# EAGLE design MainBoard 1.3.2 (EAGLE 9.6.2)
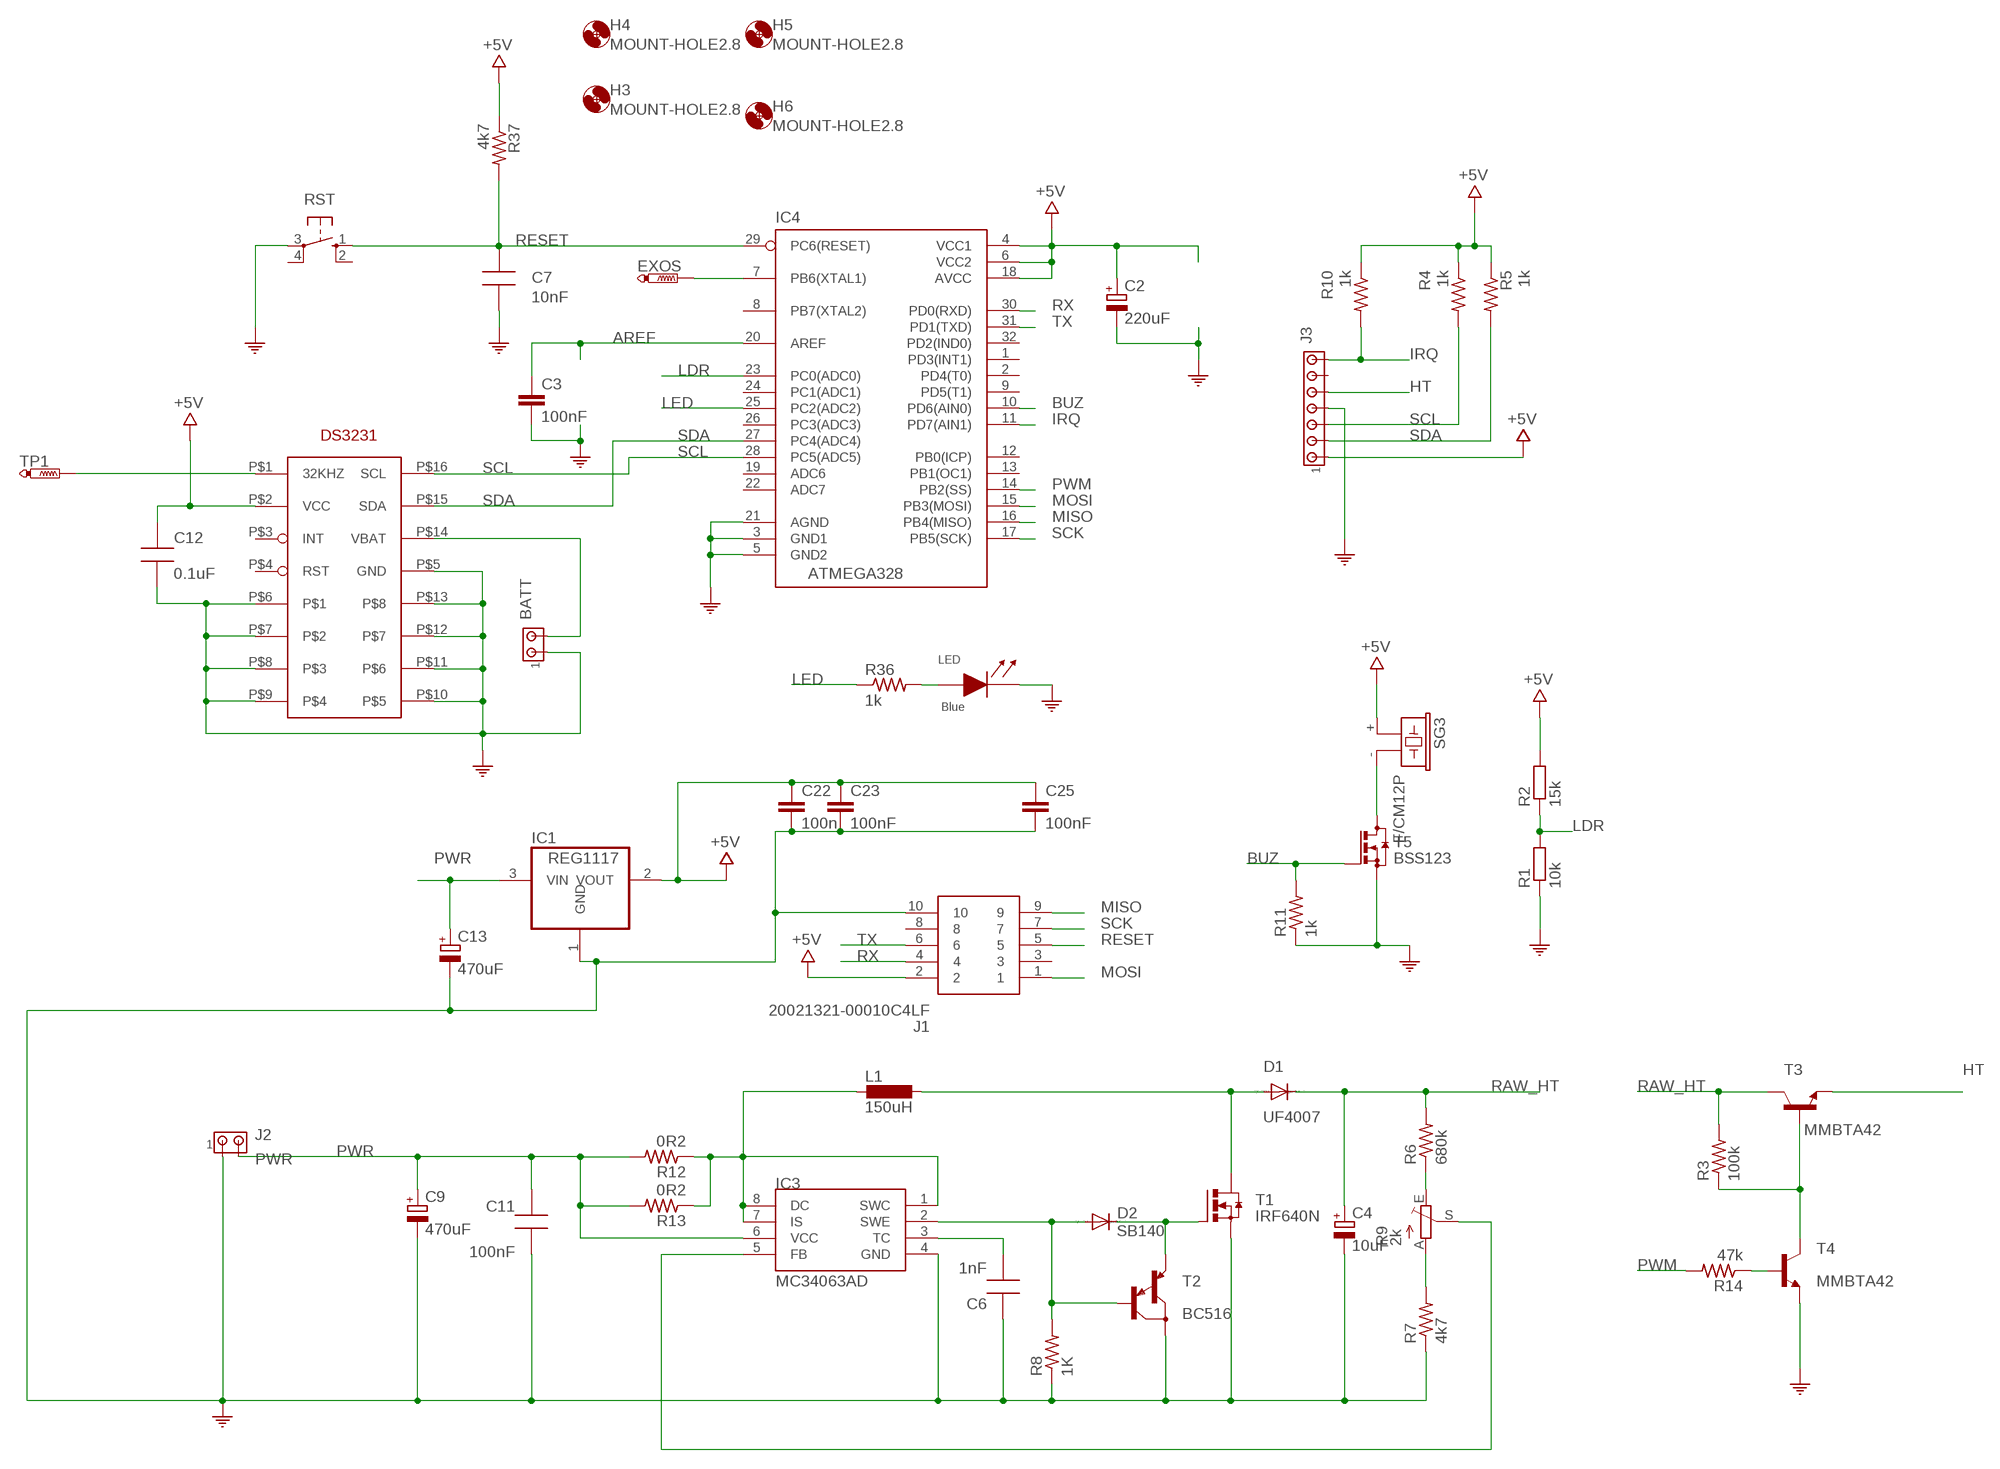
[diagram p0: schematic, sheet 1]

## Parts
BATT  MTA02-100  [10X02MTA]
C2  220uF  CPOL-EUSMCD  [SMC_D]
C3  100nF  C-EUC0603  [C0603]
C4  10uF  CPOL-EUE3.5-10  [E3,5-10]
C6  1nF  CAP0805-NP  [CAP0805-NP]
C7  10nF  CAP0805-NP  [CAP0805-NP]
C9  470uF  CPOL-EUSMCD  [SMC_D]
C11  100nF  CAP0805-NP  [CAP0805-NP]
C12  0.1uF  CAP0805-NP  [CAP0805-NP]
C13  470uF  CPOL-EUSMCD  [SMC_D]
C22  100n  C-EUC0603  [C0603]
C23  100nF  C-EUC0603  [C0603]
C25  100nF  C-EUC0603  [C0603]
D1  UF4007  BYT01  [F126-10]
D2  SB140  DIODE-DO07  [DO07]
EXOS  PTR1TP09R  [TP09R]
H3  MOUNT-HOLE2.8  [2,8]
H4  MOUNT-HOLE2.8  [2,8]
H5  MOUNT-HOLE2.8  [2,8]
H6  MOUNT-HOLE2.8  [2,8]
IC1  REG1117  [SOT223]
IC3  MC34063AD  [SOIC8]
IC4  ATMEGA328  ATMEGA168-20AU  [QFP032]
IC5  DS3231SPIC16W  [SOIC-16W]
J1  20021321-00010C4LF  [2002132100010C4LF]
J2  PWR  MTA02-100  [10X02MTA]
J3  MTA07-100  [10X07MTA]
L1  150uH  DO3316P  [D0522P]
LED  Blue  LED0805  [LED0805]
R1  10k  R-EU_M2012  [M2012]
R2  15k  R-EU_0204/2V  [0204V]
R3  100k  R-US_R2012  [R2012]
R4  1k  R-US_M2012  [M2012]
R5  1k  R-US_M2012  [M2012]
R6  680k  R-US_R2012  [R2012]
R7  4k7  R-US_R2012  [R2012]
R8  1K  R-US_R2012  [R2012]
R9  2k  TRIM_EU-B25P  [B25P]
R10  1k  R-US_M2012  [M2012]
R11  1k  R-US_M2012  [M2012]
R12  0R2  R-US_R2010  [R2010]
R13  0R2  R-US_R2010  [R2010]
R14  47k  R-US_R2012  [R2012]
R36  1k  R-US_M2012  [M2012]
R37  4k7  R-US_M2012  [M2012]
RST  10-XX  [B3F-10XX]
SG3  F/CM12P  [F/CM12P]
T1  IRF640N  IRF3704S  [D2PACK]
T2  BC516  [TO92]
T3  MMBTA42  BC846  [SOT23]
T4  MMBTA42  BC846  [SOT23]
T5  BSS123  [SOT23]
TP1  PTR1TP09R  [TP09R]

## Nets
+5V [pwr]: C2.+ C12.1 C22.1 C23.1 C25.1 IC1.2(VOUT) IC4.4(VCC1) IC4.6(VCC2) IC4.18(AVCC) IC5.P$2(VCC) J1.2 J3.1 R2.2 R4.1 R5.1 R10.1 R37.1 SG3.+
AREF: C3.1 IC4.20(AREF)
BATT: BATT.2 IC5.P$14(VBAT)
BUZ: IC4.10(PD6(AIN0)) R11.2 T5.1(G)
GND: BATT.1 C2.- C3.2 C4.- C6.1 C7.2 C9.- C11.1 C12.2 C13.- C22.2 C23.2 C25.2 IC1.1(GND) IC3.4(GND) IC4.3(GND1) IC4.5(GND2) IC4.21(AGND) IC5.P$5(GND) IC5.P$6 IC5.P$7 IC5.P$8 IC5.P$9 IC5.P$10 IC5.P$11 IC5.P$12 IC5.P$13 J1.10 J2.1 J3.4 LED.1(CA) R1.1 R7.1 R8.1 R11.1 RST.3(P) T1.3(S) T2.3(C) T4.2(E) T5.2(S) ; supply symbol labelled COM
HT: J3.5 T3.2(E)
IRQ: IC4.11(PD7(AIN1)) J3.7 R10.2
LDR: IC4.23(PC0(ADC0)) R1.2 R2.1
LED: IC4.25(PC2(ADC2)) R36.1
MISO: IC4.16(PB4(MISO)) J1.9
MOSI: IC4.15(PB3(MOSI)) J1.1
N$1: IC5.P$1(32KHZ) TP1.TP
N$2: D1.A L1.P$2 T1.2(D)
N$3: SG3.- T5.3(D)
N$5: EXOS.TP IC4.7(PB6(XTAL1))
N$6: C6.2 IC3.3(TC)
N$7: R3.1 T3.1(B) T4.3(C)
N$9: R7.2 R9.A
N$10: D2.A IC3.2(SWE) R8.2 T2.2(B)
N$11: R6.1 R9.E
N$15: LED.2(AN) R36.2
N$16: IC3.5(FB) R9.S
N$17: IC3.1(SWC) IC3.7(IS) IC3.8(DC) L1.P$1 R12.1 R13.1
N$19: R14.1 T4.1(B)
N$21: D2.C T1.1(G) T2.1(E)
PWM: IC4.14(PB2(SS)) R14.2
PWR [pwr]: C9.+ C11.2 C13.+ IC1.3(VIN) IC3.6(VCC) J2.2 R12.2 R13.2
RAW_HT: C4.+ D1.C R3.2 R6.2 T3.3(C)
RESET: C7.1 IC4.29(PC6(RESET)) J1.5 R37.2 RST.1(S)
RX: IC4.30(PD0(RXD)) J1.4
SCK: IC4.17(PB5(SCK)) J1.7
SCL: IC4.28(PC5(ADC5)) IC5.P$16(SCL) J3.3 R4.2
SDA: IC4.27(PC4(ADC4)) IC5.P$15(SDA) J3.2 R5.2
TX: IC4.31(PD1(TXD)) J1.6
Unconnected: IC4.1(PD3(INT1)) IC4.2(PD4(T0)) IC4.8(PB7(XTAL2)) IC4.9(PD5(T1)) IC4.12(PB0(ICP)) IC4.13(PB1(OC1)) IC4.19(ADC6) IC4.22(ADC7) IC4.24(PC1(ADC1)) IC4.26(PC3(ADC3)) IC4.32(PD2(IND0)) IC5.P$3(INT) IC5.P$4(RST) J1.3 J1.8 J3.6 RST.2(S1) RST.4(P1)

## Library data of the parts
BATT J2 = con-amp:MTA02-100: AMP connector
C2 C9 C13 = rcl:CPOL-EU: POLARIZED CAPACITOR, European symbol
C3 C22 C23 C25 = rcl:C-EU: CAPACITOR, European symbol; SPICEPREFIX: C
C4 = resistor:CPOL-EU: POLARIZED CAPACITOR, European symbol
C6 C7 C11 C12 = MySMD:CAP0805-NP
D1 = diode:BYT01: DIODE ultra fast
D2 = diode:DIODE-: DIODE
EXOS TP1 = testpad:PTR1: TEST PIN
H3-H6 = holes:MOUNT-HOLE: MOUNTING HOLE with drill center marker
IC1 = burr-brown:REG1117: 800mA and 1A Low Dropout (LDO) Positive Regulator 1.8V, 2.5V, 2.85V, 3.3V, 5V, and Adj; MPN: REG1117; OC_FARNELL: 1097566; OC_NEWARK: 14P6981
IC3 = mc34063:MC34063
IC4 = MySMD:ATMEGA168-20AU
IC5 = DS3231:DS3231; MOUSER: 700-DS3231S#
J1 = SamacSys_Parts:20021321-00010C4LF: Headers & Wire Housings 1.27x1.27mm BTB, Hdr Recept, SMT, 10 Pos Source: Datasheet <https://componentsearchengine.com/Datasheets/1/20021321-00010C4LF.pdf>; DESCRIPTION: Headers & Wire Housings 1.27x1.27mm BTB, Hdr Recept, SMT, 10 Pos; HEIGHT: 4.75mm; MANUFACTURER_NAME: Amphenol; MANUFACTURER_PART_NUMBER: 20021321-00010C4LF; MOUSER_PART_NUMBER: 649-202132100010C4LF; MOUSER_PRICE-STOCK: https://www.mouser.com/Search/Refine.aspx?Keyword=649-202132100010C4LF
J3 = con-amp:MTA07-100: AMP connector
L1 = inductor-coilcraft:DO3316P: COILCRAFT; MOUSER: 994-DO5022P-154MLB
LED = MySMD:LED0805
R1 R2 = resistor:R-EU_: RESISTOR, European symbol
R3-R8 R10-R14 R36 R37 = adafruit:R-US_: RESISTOR, American symbol
R9 = pot:TRIM_EU-: POTENTIOMETER
RST = switch-omron:10-XX: OMRON SWITCH; MPN: B3F-1000; OC_FARNELL: 176432; OC_NEWARK: 36M3542
SG3 = buzzer:F/CM12P: BUZZER Source: Buerklin; OC_FARNELL: unknown; OC_NEWARK: unknown
T1 = transistor-power:IRF3704: SMPS MOSFET HEXFET® Power MOSFET Source: http://www.irf.com/product-info/datasheets/data/irf3704.pdf; MOUSER: 942-IRF640NSTRLPBF
T2 = transistor-pnp:BC516: PNP Darlington Transistor
T3 T4 = transistor:BC846: NPN TRANSISTOR
T5 = transistor-small-signal:BSS123: N-CHANNEL MOS FET; MOUSER: 512-BSS123

## Module TUBEIN16
Ports: 

### Library data of the parts

## Net classes
0 default: width 0.254 mm, clearance 0.254 mm
1 pwr: width 0.254 mm, clearance 0.356 mm

## Board
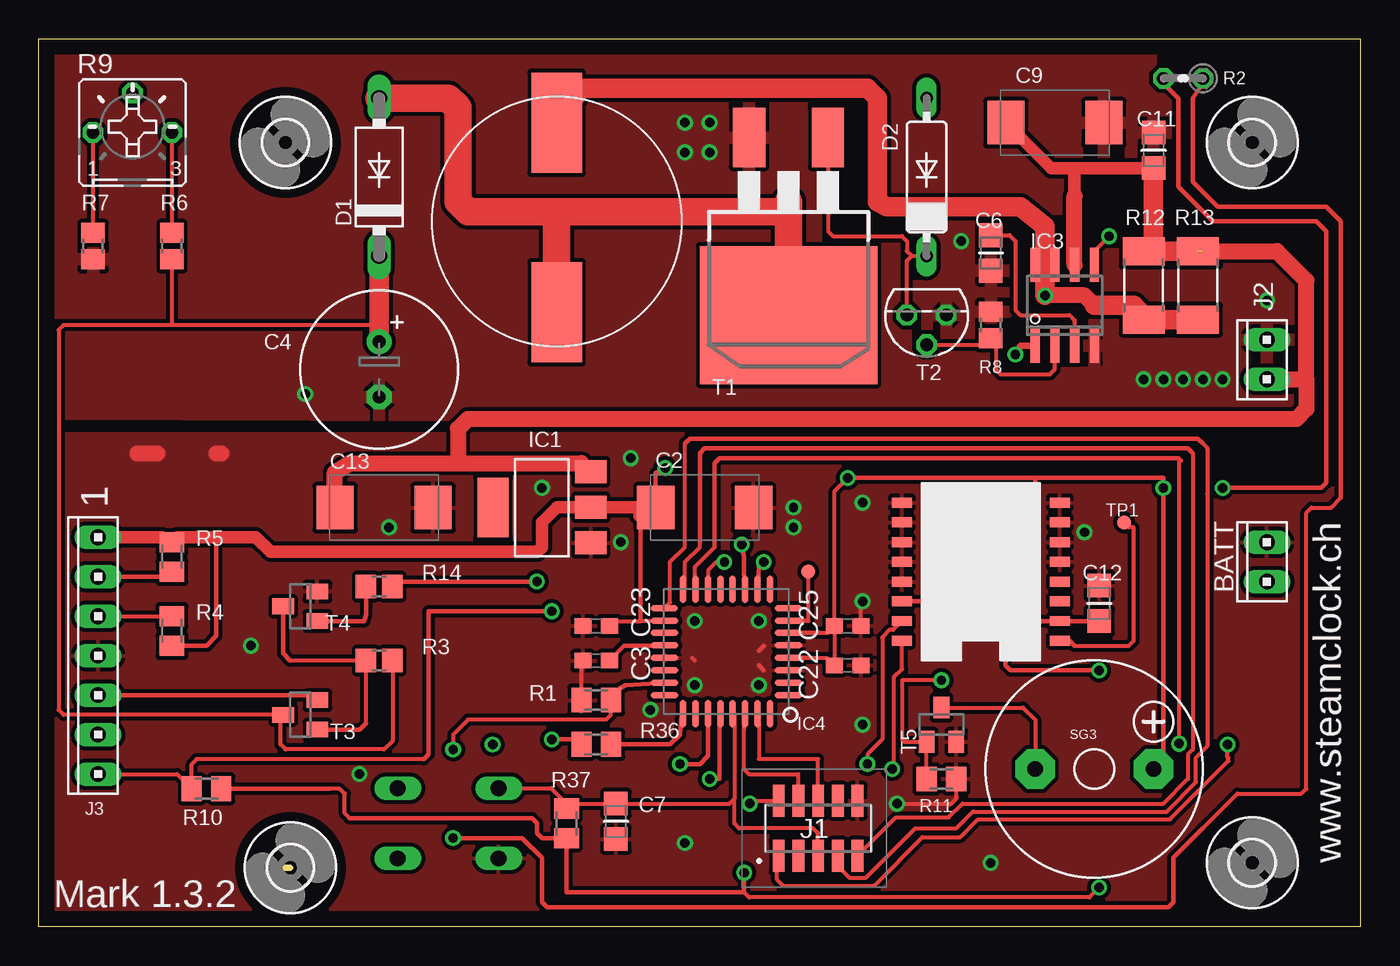
[diagram p1: board, top side]
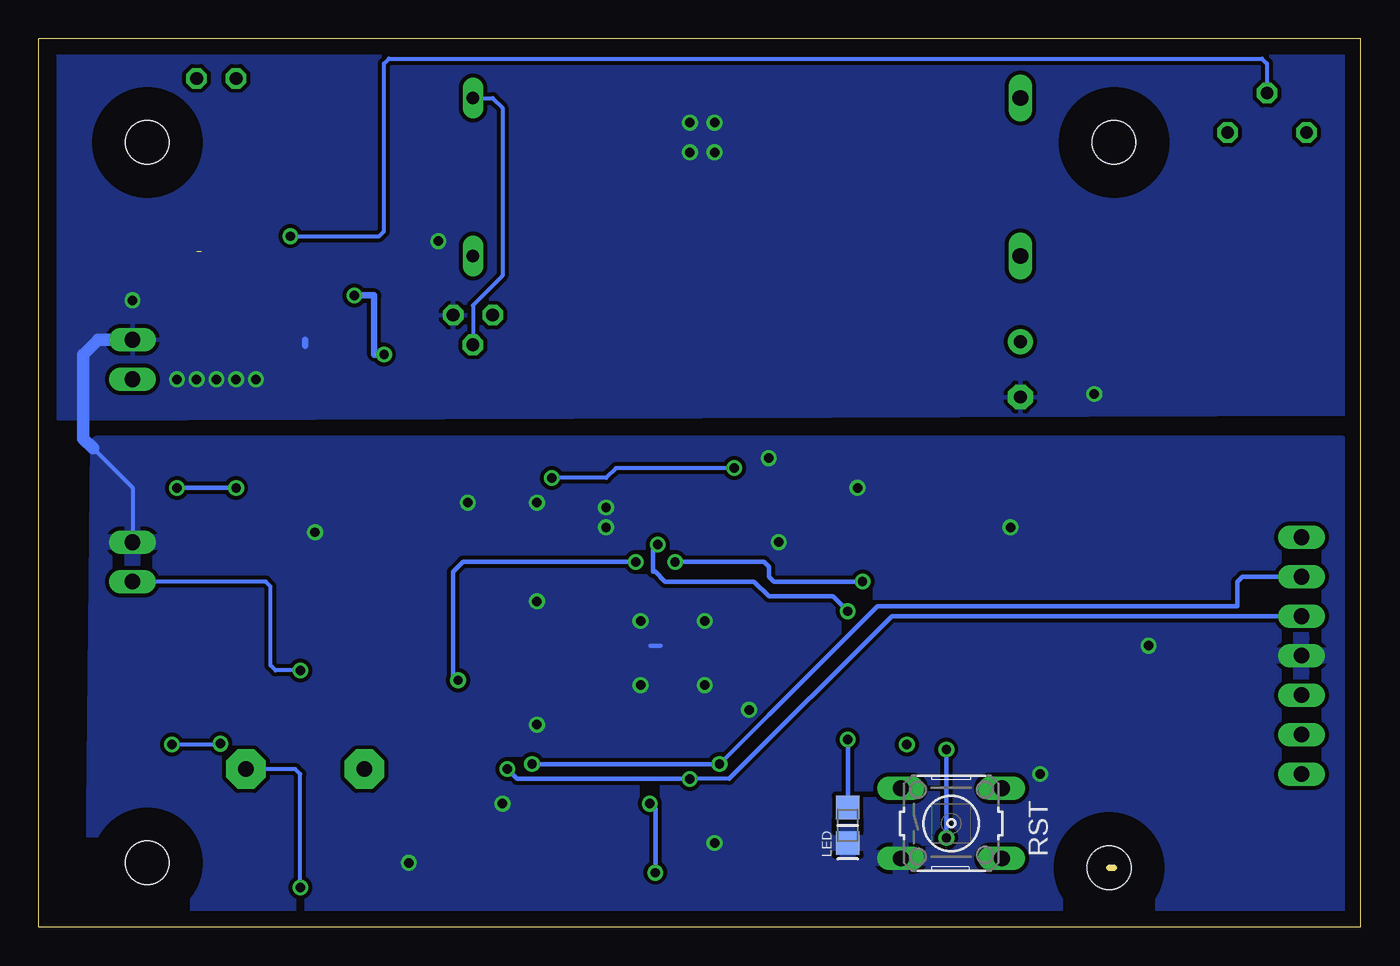
[diagram p2: board, bottom side, seen from below]

Size 85.09 x 57.15 mm. Coordinates in mm from the lower left corner, seen from the top.
Outline: 16.19,3.81 15.88,3.81
Outline: 85.09,0 85.09,57.15 0,57.15 0,0 85.09,0
Copper layers (1*16): Top 0.035mm / dielectric 1.5mm / Bottom 0.035mm
Design rules "default": minimum track width 10mil, minimum drill 24mil, track to track 8mil, track to pad 8mil, pad to pad 8mil, via to via 8mil, smd to smd 8mil, copper to edge 40mil, drill to drill 8mil, minimum pad ring 10mil, minimum via ring 8mil, stop-mask expansion 4mil, vias tented up to drill 0mil, thermal gap 10mil

### Footprints (pad centres in the part's own frame; a part is rotated, then mirrored left to right if it is on the bottom)
10X02MTA = drill 1.016 long: 1 1.27,0; 2 -1.27,0
SMC_D = smd 2.4 x 2.8: + -3.15,0; - 3.15,0
C0603 = smd 1.1 x 1: 1 -0.85,0; 2 0.85,0
E3,5-10 = drill 0.813 pad 1.6: + -1.778,0 | drill 0.813 pad 1.6 octagon: - 1.778,0
CAP0805-NP = smd 1.524 x 1.524: 1 0,0; 2 2.286,0
F126-10 = drill 1.016 long: A 5.08,0; C -5.08,0
DO07 = drill 0.813 long: A 5.08,0; C -5.08,0
TP09R = smd 0.9 x 0.9: TP 0,0
2,8 = hole 2.8: 0,0
SOT223 = smd 1.499 x 2.007: 1 -2.261,-3.15; 2 0.025,-3.15; 3 2.311,-3.15 | smd 3.81 x 2.007: 4 0,3.15
SOIC8 = smd 0.6 x 2.2: 1 -1.905,-2.6; 2 -0.635,-2.6; 3 0.635,-2.6; 4 1.905,-2.6; 5 1.905,2.6; 6 0.635,2.6; 7 -0.635,2.6; 8 -1.905,2.6
QFP032 = smd 0.432 x 1.778: 1 0,0; 2 0.8,0; 3 1.599,0; 4 2.399,0; 5 3.199,0; 6 3.998,0; 7 4.798,0; 8 5.598,0; 17 5.588,8.001; 18 4.798,7.997; 19 3.998,7.997; 20 3.199,7.997; 21 2.399,7.997; 22 1.599,7.997; 23 0.799,7.997; 24 0,7.997 | smd 1.778 x 0.432: 9 6.807,1.194; 10 6.807,2.007; 11 6.807,2.794; 12 6.807,3.607; 13 6.807,4.394; 14 6.807,5.182; 15 6.807,5.994; 16 6.816,6.803; 25 -1.194,6.807; 26 -1.194,5.994; 27 -1.194,5.182; 28 -1.194,4.394; 29 -1.194,3.607; 30 -1.194,2.794; 31 -1.194,2.007; 32 -1.194,1.194
SOIC-16W = smd 0.635 x 1.27: P$1 -16.51,-1.27; P$2 -15.24,-1.27; P$3 -13.97,-1.27; P$4 -12.7,-1.27; P$5 -11.43,-1.27; P$6 -10.16,-1.27; P$7 -8.89,-1.27; P$8 -7.62,-1.27; P$9 -7.62,8.89; P$10 -8.89,8.89; P$11 -10.16,8.89; P$12 -11.43,8.89; P$13 -12.7,8.89; P$14 -13.97,8.89; P$15 -15.24,8.89; P$16 -16.51,8.89
2002132100010C4LF = smd 0.76 x 2.05: 1 2.54,1.775; 2 2.54,-1.775; 3 1.27,1.775; 4 1.27,-1.775; 5 0,1.775; 6 0,-1.775; 7 -1.27,1.775; 8 -1.27,-1.775; 9 -2.54,1.775; 10 -2.54,-1.775
10X07MTA = drill 1.016 long: 1 7.62,0; 2 5.08,0; 3 2.54,0; 4 0,0; 5 -2.54,0; 6 -5.08,0; 7 -7.62,0
D0522P = smd 3.251 x 6.452: P$1 0,6.35; P$2 0,-5.842
LED0805 = smd 1.524 x 1.524: 1 0,0; 2 2.286,0
M2012 = smd 1.3 x 1.6: 1 -0.95,0; 2 0.95,0
0204V = drill 0.813 octagon: 1 -1.27,0; 2 1.27,0
R2012 = smd 1.3 x 1.5: 1 -0.85,0; 2 0.85,0
B25P = drill 0.813 octagon: A -2.54,0; E 2.54,0; S 0,2.54
R2010 = smd 1.8 x 2.7: 1 -2.2,0; 2 2.2,0
B3F-10XX = drill 1.016 long: 1 -3.251,2.261; 2 3.251,2.261; 3 -3.251,-2.261; 4 3.251,-2.261
F/CM12P = drill 1.016 pad 2.54 octagon: + 3.81,0; - -3.81,0
D2PACK = smd 2.083 x 3.81: 1 -2.54,-8.89; 3 2.54,-8.89 | smd 11.43 x 8.89: 2 0,2.54
TO92 = drill 0.813 octagon: 1 1.27,0; 2 0,1.905; 3 -1.27,0
SOT23 = smd 1 x 1.4: 1 -0.95,-1.1; 2 0.95,-1.1; 3 0,1.1

### Placement (x,y rotation side)
BATT  79.06,23.5 90 top
C2  42.86,26.99 0 top
C3  35.88,17.14 180 top
C4  21.91,35.88 270 top
C6  61.28,42.23 90 top
C7  37.15,7.94 270 top
C9  65.41,51.75 0 top
C11  71.75,51.12 270 top
C12  68.26,19.68 90 top
C13  22.23,26.99 0 top
C22  52.07,16.83 0 top
C23  35.88,19.37 180 top
C25  52.07,19.37 0 top
D1  21.91,48.26 90 top
D2  57.15,48.26 90 top
EXOS  49.53,22.86 0 top
H3  15.88,50.48 0 top
H4  16.19,3.81 0 top
H5  78.11,4.13 0 top
H6  78.11,50.48 0 top
IC1  32.38,26.99 90 top
IC3  66.04,40.01 0 top
IC4  48.26,14.92 90 top
IC5  64.45,34.92 90 top
J1  50.16,6.35 180 top
J2  79.06,36.51 90 top
J3  3.81,17.46 90 top
L1  33.34,45.4 0 top
LED  33.02,5.4 90 bottom
R1  35.88,14.61 0 top
R2  73.66,54.61 180 top
R3  21.91,17.14 0 top
R4  8.57,19.05 90 top
R5  8.57,23.81 270 top
R6  8.57,43.81 270 top
R7  3.49,43.81 90 top
R8  61.28,38.73 270 top
R9  6.03,51.12 0 top
R10  10.79,8.89 180 top
R11  58.1,9.53 180 top
R12  71.12,41.27 90 top
R13  74.61,41.27 90 top
R14  21.91,21.91 0 top
R36  35.88,11.75 180 top
R37  33.97,6.67 90 top
RST  26.35,6.67 0 bottom
SG3  67.94,10.16 0 top
T1  48.26,41.91 180 top
T2  57.15,39.37 180 top
T3  16.83,13.65 90 top
T4  16.83,20.64 90 top
T5  58.1,13.02 0 top
TP1  69.85,26.04 180 top

### Tracks (layer width: path | path; a pad name or v marks a point on that pad's centre or on a via)
+5V  (via drill 0.6, 0.61)
  Top 0.254: 20,6.99 19.68,7.3 19.68,8.57 19.37,8.89 18.73,8.89 | v45.76,7.94 45.95,8.12 J1.2 | 50.29,18.92 50.77,18.92 C25.1 | 49.71,17.32 50.73,17.32 C22.1 C25.1 | C25.1 51.22,28.04 v52.07,28.89 | C23.1 37.05,19.68 38.73,19.68 | v68.26,2.54 67.63,1.91 45.72,1.91 45.4,2.22
  Top 0.305: IC4.6 50.29,18.92 | IC4.4 49.71,17.32 | 64.14,28.89 64.14,20 64.45,19.68 IC5.P$2 C12.1 | 64.14,28.89 72.39,28.89 v72.39,28.26 72.39,10.79 SG3.+ | 64.14,28.89 v52.07,28.89 | C2.+ 39.69,28.89 39.69,29.21 v40.32,29.53 | IC4.18 38.73,19.68 38.73,26.04 38.42,26.35 38.41,26.97 | v45.4,3.49 45.4,2.22 33.97,2.22 R37.1 32.38,5.71 32.07,6.03 32.07,6.67 31.75,6.99 20,6.99 | 18.73,8.89 R10.1 | R2.2 72.39,54.29 73.34,53.34 73.34,47.62 75.56,45.4 82.23,45.4 82.87,44.77 82.87,28.57 82.55,28.26 v76.2,28.26 | 7.94,25.08 8.26,24.76 R5.1 | R4.1 10.79,18.1 11.43,18.73 11.43,25.08
  Top 0.406: 38.41,26.97 C2.+
  Top 0.813: C2.+ 39.71,27.01 IC1.2 33.36,27.01 32.38,26.04 32.38,24.45 32.07,24.13 14.92,24.13 13.97,25.08 11.43,25.08 8.89,25.08 R5.1 | J3.1 7.94,25.08
  Bottom 0.254: v40.32,29.53 47.94,29.53 48.58,28.89 v52.07,28.89 | v68.26,2.54 68.26,9.84 68.58,10.16 SG3.+ | 45.72,7.94 v45.76,7.94
  Bottom 0.305: v76.2,28.26 v72.39,28.26 | 45.72,7.94 45.4,7.62 v45.4,3.49
AREF
  Top 0.254: C3.1 37.68,18.1 37.78,18.1
  Top 0.305: 37.78,18.1 40.24,18.1 IC4.20
BATT  (via drill 0.6)
  Top 0.305: IC5.P$14 61.91,20.95 62.23,20.64 62.23,16.83 62.55,16.51 v68.26,16.51
  Bottom 0.254: v68.26,16.51 69.85,16.51 70.17,16.83 70.17,21.91 70.48,22.23 BATT.2
BUZ  (via drill 0.6)
  Top 0.254: v58.1,15.88 55.56,15.88 55.56,12.06 55.71,11.92 T5.1 | T5.1 | R11.2 T5.1
  Top 0.305: IC4.10 46.35,23.18 v46.67,23.5
  Bottom 0.305: v58.1,15.88 58.42,16.19 58.42,22.86 57.78,23.5 v46.67,23.5
GND  (via drill 0.61)
  Top 0.254: C7.2 37.11,5.65 37.11,5.36 | 17.78,21.59 T4.2 | v55.24,7.94 58.74,7.94 59.05,8.26 R11.1 | C25.2 52.92,20.85 v53.02,20.95 | 42.05,17.32 42.23,17.14 | R1.1 34.93,17.05 C3.2 | 37.15,24.77 37.11,24.73
  Top 0.305: 46.66,16.52 46.35,16.83 | 46.35,17.78 46.67,18.1
  Top 0.406: 18.1,21.59 T4.2
  Top 1.016: 6.35,30.48 7.62,30.48 | 11.43,30.48 11.75,30.48
  Bottom 0.254: 81.6,30.8 79.06,28.26 BATT.1
  Bottom 0.305: 45.72,18.1 45.09,18.1
  Bottom 0.406: 67.94,37.78 IC3.4
  Bottom 0.813: J2.1 81.28,37.78 82.23,36.83 82.23,31.43 81.6,30.8
  other vias: 53.02,13.02 20.64,9.84 61.28,4.13 22.54,25.72 37.47,24.77 48.58,25.72 48.58,26.99 32.38,28.26 38.1,30.16 39.37,13.97 41.59,5.4 13.65,18.1 67.31,25.4 57.47,27.3 76.2,35.24 59.37,44.13 41.59,51.75 41.59,49.85 43.18,51.75 43.18,49.85 74.93,35.24 73.66,35.24 72.39,35.24 71.12,35.24 42.23,19.68 46.35,19.68 42.23,15.56 46.35,15.56 17.14,34.29 79.06,40.32 53.02,27.3
  pour Top: 0.95,56.52 0.95,33.02 83.82,32.7 83.82,55.88
  pour Bottom: 1.27,31.11 0.95,0.95 5.71,0.32 81.6,1.59 81.28,31.11
  pour Bottom (rank 6): 0.64,56.83 83.82,56.83 83.82,32.7 0.95,33.02
  pour Top: 1.59,31.75 84.45,31.75 84.45,0 0,0 0,30.16
HT
  Top 0.305: J3.5 17.46,14.92 17.78,14.6 T3.2
IRQ  (via drill 0.6)
  Top 0.254: 24.77,10.79 10.16,10.79 9.85,10.48 R10.2 8.89,9.84 J3.7
  Top 0.305: IC4.11 45.4,22.86 45.4,23.81 v45.24,24.61 | v33.02,20.32 25.08,20.32 25.08,11.11 24.77,10.79
  Bottom 0.305: v45.24,24.61 45.56,24.29 45.56,22.87 45.42,22.88 44.77,22.23 39.05,22.23 38.1,21.27 33.97,21.27 v33.02,20.32
LDR  (via drill 0.6)
  Top 0.254: R1.2 36.83,13.65 36.51,13.34 27.62,13.34 26.67,12.38 v26.67,11.43 | 74.93,6.35 77.15,8.57 81.28,8.57 81.6,8.89 81.6,26.67 81.92,26.99 83.19,26.99 83.82,27.62
  Top 0.305: 74.93,6.35 73.03,4.45 73.03,1.59 72.71,1.27 32.7,1.27 32.38,1.59 32.38,4.45 31.11,5.71 v26.67,5.71 | IC4.23 37.78,15.56 37.4,15.37 R1.2 | R2.1 74.93,54.29 74.3,53.34 74.3,47.94 75.88,46.35 82.87,46.35 83.82,45.4 83.82,27.62
  Bottom 0.305: v26.67,5.71 v26.67,11.43
LED
  Top 0.305: IC4.25 41.38,13.65 41.27,12.38 40.64,11.75 R36.1
MISO
  Top 0.254: IC4.16 41.59,21.87 41.59,23.5 42.55,24.45 42.55,24.77 | J1.9 55.18,7.05 58.57,7.05 59.46,7.94 72.39,7.94 73.98,9.53 73.98,11.11 74.3,11.43 74.3,30.48
  Top 0.305: 42.55,24.77 42.55,30.48 42.86,30.8 73.98,30.8 74.3,30.48
MOSI  (via drill 0.61)
  Top 0.254: IC4.15 42.23,21.77 42.23,23.18 43.5,24.45 | J1.1 47.5,4.45 47.5,3.08 47.91,2.66 53.78,2.66 56.9,5.78 59.31,5.78 60.45,6.92 72.81,6.92 76.58,10.69 76.58,10.86 76.52,10.92 v76.52,11.75 | v73.41,11.8 73.41,29.91 73.5,30
  Top 0.305: 43.5,24.45 43.5,29.84 43.81,30.16 73.34,30.16 73.5,30
  Bottom 0.254: v73.41,11.8 73.46,11.75 v76.52,11.75
N$1
  Top 0.254: 66.67,18.1 70.17,18.1 70.48,18.41 70.48,25.72 70.17,25.72 TP1.TP
  Top 0.305: 66.67,18.1 66.36,18.41 IC5.P$1
N$2
  Top 1.778: L1.P$2 33.34,46.04 | 33.34,46.04 27.62,46.04 26.99,46.67 26.99,52.7 26.35,53.34 D1.A | 33.34,46.04 47.94,46.04 48.26,46.67 T1.2
N$3
  Top 0.254: T5.3 63.35,14.12 64.14,13.34 SG3.-
N$5
  Top 0.254: 49.53,19.72 EXOS.TP
  Top 0.305: IC4.7 49.53,19.72
N$6
  Top 0.254: C6.2 62.48,44.51 62.87,44.13 62.87,39.69 63.18,39.37 66.36,39.37 66.67,39.05 IC3.3
N$7
  Top 0.254: 16.19,17.14 R3.1 21.06,13.12
  Top 0.305: 16.19,17.14 15.73,17.61 T4.3 | T3.1 18.25,12.7 20.64,12.7 21.06,13.12
N$9
  Top 0.254: R7.2 R9.A
N$10
  Top 0.254: T2.2 60.86,37.47 R8.2 61.59,37.57 61.59,35.88 61.91,35.56 65.09,35.56 65.41,35.88 IC3.2
  Bottom 0.254: D2.A 55.88,53.34 55.24,52.7 55.24,41.91 57.15,40.01 T2.2
N$11
  Top 0.254: R6.1 R9.E
N$15  (via drill 0.6)
  Top 0.305: v33.02,12.06 34.29,12.06 34.93,12.06 R36.2
  Bottom 0.305: LED.2 v33.02,12.06
N$16  (via drill 0.6)
  Top 0.254: IC3.5 67.94,43.5 v68.9,44.45
  Bottom 0.254: v68.9,44.45 63.18,44.45 62.87,44.77 62.87,55.56 62.55,55.88 6.35,55.88 6.03,55.56 R9.S
N$17  (via drill 0.6)
  Top 0.254: IC3.7 65.41,42.55 64.77,41.91
  Top 0.406: IC3.1 63.18,37.41 v62.87,36.83
  Top 0.61: IC3.7 IC3.8 64.77,42.86
  Top 1.016: 64.77,42.86 64.77,43.81 | 67.94,40.01 67.31,40.64 v64.77,40.64
  Top 1.27: 64.77,43.81 64.77,45.09 63.18,46.35 54.61,46.35 53.98,46.67 53.98,53.34 53.34,53.98 34.92,53.98 L1.P$1 | 67.94,40.01 70.48,40.01 71.12,39.37 R12.1 R13.1 | 64.77,41.91 v64.77,40.64
  Bottom 0.406: v62.87,36.83 63.5,36.83 63.5,40.64 v64.77,40.64
N$18  (via drill 0.61)
  other vias: 29.21,11.75
N$19
  Top 0.305: T4.1 18.25,19.68 20.95,19.68 21.06,20.11 R14.1
N$21
  Top 0.254: T2.1 55.88,42.86 56.2,43.18 | 56.2,43.18 D2.C | T1.1 50.8,44.77 51.12,44.45 55.56,44.45 55.88,44.13 55.88,43.5 56.2,43.18
PWM  (via drill 0.6)
  Top 0.254: IC4.14 43.12,21.77 43.12,22.99 43.62,23.5 v44.13,23.5
  Top 0.305: v32.07,22.23 23.07,22.23 R14.2
  Bottom 0.305: v32.07,22.23 37.78,22.23 38.1,22.54 38.1,23.18 38.42,23.5 v44.13,23.5
PWR  (1 unrouted)
  Top 0.254: 71.75,48.26 71.75,48.58 C11.2 | IC1.3 35.47,29.3 34.92,29.84
  Top 0.406: 79.08,35.24 J2.2
  Top 0.813: 34.92,29.84 35.56,29.53 | C13.+ 19.05,26.99 | C9.+ 65.18,48.83 66.67,48.83 | 66.67,48.83 C11.2 | 66.67,47.02 66.67,48.83
  Top 1.016: IC3.6 66.67,47.02 | 74.93,43.5 79.69,43.5 81.6,41.59 81.6,35.24 | 81.6,35.24 81.6,33.34 80.96,32.7 27.62,32.7 26.99,32.07 26.99,29.84 | 26.99,29.84 34.92,29.84 | 26.99,29.84 20,29.84 19.05,29.23 19.05,26.99 | J2.2 81.6,35.24
  Top 1.27: 71.75,48.58 71.75,44.11 R12.2 R13.2
RAW_HT
  Top 0.254: C4.+ 21.78,38.73 8.57,38.73 | 8.57,38.73 R6.2 | 8.57,38.73 1.59,38.73 1.27,38.42 1.27,13.97 1.59,13.65 15.56,13.65 | 15.56,13.65 T3.3 | R3.2 22.76,11.96 22.23,11.43 15.88,11.43 15.56,11.75 15.56,13.65
  Top 1.27: D1.C C4.+
RESET
  Top 0.254: IC4.29 44.77,13.73 44.77,8.26 | J1.5 50.16,6.03 49.85,6.35 45.09,6.35 44.77,6.67 44.77,8.26 | 44.77,8.26 44.45,7.94 C7.1 34.29,7.94 R37.2 33.97,7.94 32.98,8.93 RST.1
RX
  Top 0.254: 45.4,12.7 45.4,10.16 45.72,9.84 48.9,9.84 J1.4
  Top 0.305: IC4.30 45.4,12.7
SCK
  Top 0.254: 41.59,31.11 41.59,24.45 40.64,23.5 40.64,20.89 IC4.17 | J1.7 51.31,4.45 51.31,4.03 52.17,3.17 53.24,3.17 56.42,6.35 59.05,6.35 60.13,7.43 72.6,7.43 74.49,9.31 74.49,10.9 75.25,11.66 75.25,27.82 75.21,27.85 75.21,30.83 74.93,31.11
  Top 0.305: 41.59,31.11 41.91,31.43 74.61,31.43 74.93,31.11
SCL  (via drill 0.6)
  Top 0.254: 54.61,10.16 55.05,10.16 55.05,16.09 55.56,16.59 IC5.P$16 | J3.3 R4.2
  Top 0.305: IC4.28 43.81,13.78 43.81,9.53 v43.18,9.53 | v54.93,10.16 54.61,10.16
  Bottom 0.254: 40.66,9.53 v43.18,9.53
  Bottom 0.305: J3.3 30.18,20 40.66,9.53 | v54.93,10.16 54.29,9.53 v43.18,9.53
SDA  (via drill 0.6)
  Top 0.254: IC5.P$15 54.99,19.11 54.77,19.11 54.29,18.64 54.29,12.06 53.34,11.11 v53.34,10.48
  Top 0.305: J3.2 8.25,22.54 R5.2 | IC4.27 43.08,11.01 42.55,10.48 v41.27,10.48
  Bottom 0.254: v41.27,10.48 38.1,13.65
  Bottom 0.305: J3.2 7.62,22.54 7.94,22.23 7.94,20.64 31.11,20.64 38.1,13.65 | v53.34,10.48 v41.27,10.48
TX
  Top 0.254: IC4.31 46.35,13.63 46.35,10.79 50.16,10.79 J1.6

### Text on the board
tNames: 1 | www.steamclock.ch | Mark 1.3.2